# EAGLE design detector_t85-pu (EAGLE 7.6.0)

## Sheet 1 of 2
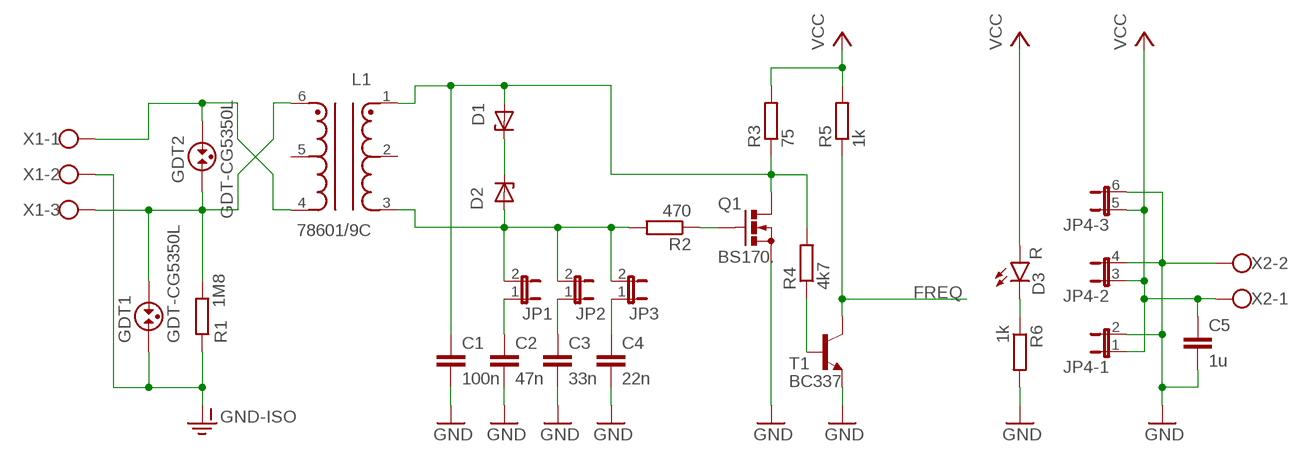
[diagram p0: schematic, sheet 1]

### Parts
C1  100n  C-EU050-024X044  [C050-024X044]
C2  47n  C-EU050-024X044  [C050-024X044]
C3  33n  C-EU050-024X044  [C050-024X044]
C4  22n  C-EU050-024X044  [C050-024X044]
C5  1u  C-EU050-025X075  [C050-025X075]
D1  24V  ZENER-DIODEZD-5  [ZDIO-5]
D2  24V  ZENER-DIODEZD-5  [ZDIO-5]
D3  R  LED3MM  [LED3MM]
GDT1  GDT-CG5350L  [CG5350L]
GDT2  GDT-CG5350L  [CG5350L]
JP1  JUMPER-2PTH  [1X02]
JP2  JUMPER-2PTH  [1X02]
JP3  JUMPER-2PTH  [1X02]
JP4  JP3QE  [JP3Q]
L1  78601/9C  [78601/9C]
Q1  BS170.  [TO92-DGS]
R1  1M8  R-EU_0204/5  [0204/5]
R2  470  R-EU_0204/5  [0204/5]
R3  75  R-EU_0204/7  [0204/7]
R4  4k7  R-EU_0204/5  [0204/5]
R5  1k  R-EU_0204/5  [0204/5]
R6  1k  R-EU_0204/5  [0204/5]
T1  BC337  BC337-NPN-TO92-CBE  [TO92-CBE]
X1  W237-103  [W237-103]
X2  W237-102  [W237-102]

### Nets
FREQ: R5.1 T1.C ; also sheet 2
GND: C1.2 C2.2 C3.2 C4.2 C5.2 JP4.2 JP4.4 JP4.6 Q1.S R6.2 T1.E X2.2 ; also sheet 2
GND-ISO: GDT1.1 R1.1 X1.2
N$1: D1.C D2.C
N$2: R4.1 T1.B
N$3: Q1.G R2.1
N$4: C3.1 JP2.1
N$5: C4.1 JP3.1
N$6: D2.A JP1.2 JP2.2 JP3.2 L1.3 R2.2
N$7: GDT2.2 L1.4 X1.1
N$11: C2.1 JP1.1
N$14: C1.1 D1.A L1.1 Q1.D R3.1 R4.2
N$21: GDT1.2 GDT2.1 L1.6 R1.2 X1.3
N$22: D3.K(C) R6.1
VCC: C5.1 D3.A JP4.1 JP4.3 JP4.5 R3.2 R5.2 X2.1 ; also sheet 2
Unconnected: L1.2 L1.5

## Sheet 2 of 2
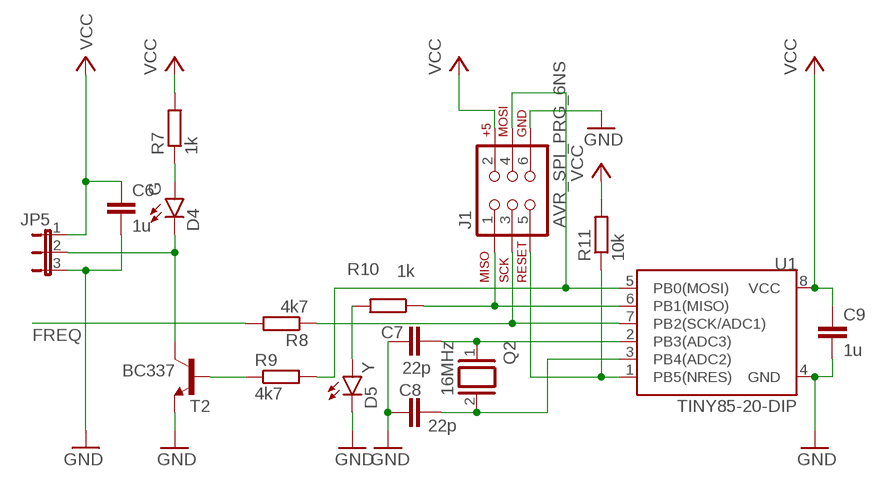
[diagram p1: schematic, sheet 2]

### Parts
C6  1u  C-EU050-025X075  [C050-025X075]
C7  22p  CAPPTH2  [CAP-PTH-SMALL2]
C8  22p  CAPPTH2  [CAP-PTH-SMALL2]
C9  1u  C-EU050-025X075  [C050-025X075]
D4  G  LED3MM  [LED3MM]
D5  Y  LED3MM  [LED3MM]
J1  AVR_SPI_PRG_6NS  [2X3-NS]
JP5  JP2E  [JP2]
Q2  16MHz  XTAL/S  [QS]
R7  1k  R-EU_0204/5  [0204/5]
R8  4k7  R-EU_0204/5  [0204/5]
R9  4k7  R-EU_0204/5  [0204/5]
R10  1k  R-EU_0204/5  [0204/5]
R11  10k  R-EU_0204/5  [0204/5]
T2  BC337  BC337-NPN-TO92-CBE  [TO92-CBE]
U1  TINY85-20-DIP  ATTINY45TINY45-20-DIP  [DIP08]

### Nets
FREQ: R8.2 ; also sheet 1
GND: C6.2 C7.1 C8.1 C9.2 D5.K(C) J1.6 JP5.3 T2.E U1.4(GND) ; also sheet 1
N$20: R9.1 T2.B
N$23: D4.K(C) JP5.2 T2.C
N$24: D4.A R7.1
N$25: C7.2 Q2.1 U1.2(PB3(ADC3))
N$26: C8.2 Q2.2 U1.3(PB4(ADC2))
N$27: D5.A R10.2
N$28: J1.1 R10.1 U1.6(PB1(MISO))
N$29: J1.4 R9.2 U1.5(PB0(MOSI))
N$30: J1.5 R11.1 U1.1(PB5(NRES))
N$31: J1.3 R8.1 U1.7(PB2(SCK/ADC1))
VCC: C6.1 C9.1 J1.2 JP5.1 R7.2 R11.2 U1.8(VCC) ; also sheet 1

## Library data of the parts
C1-C4 = resistor:C-EU: CAPACITOR, European symbol
C5 C6 C9 = rcl:C-EU: CAPACITOR, European symbol
C7 C8 = SparkFun-Capacitors:CAP: Capacitor Standard 0603 ceramic capacitor, and 0.1" leaded capacitor.
D1 D2 = diode:ZENER-DIODE: Z-Diode
D3-D5 = SparkFun-LED:LED: LEDs Standard schematic elements and footprints for 5mm, 3mm, 1206, and 0603 sized LEDs. 5mm - Spark Fun Electronics SKU : COM-00529 (and others); PROD_ID: DIO-08794
GDT1 GDT2 = supressor:GDT-: GAS DISCHARGE TUBE
J1 = SparkFun-Connectors:AVR_SPI_PRG_6: AVR ISP 6 Pin This is the reduced ISP connector for AVR programming. Common on Arduino. This footprint will take up less PCB space and can be used with a 10-pin to 6-pin adapter such as SKU: BOB-08508 **Special note about "TEST_POINT" package. The stop mask is on the top side, so if you want your programming test points to be on the bottom of your board, make sure to place this package on the bottom side of the board. This also ensure that the orientation to program from the bottom side will be correct.
JP1-JP3 = SparkFun-Retired:JUMPER-2: Jumper Basic 0.1" spaced jumper. Use with breakaway headers.
JP4 = jumper:JP3QE: JUMPER
JP5 = jumper:JP2E: JUMPER
L1 = detector:78601/9C: MuRata 78601/9C
Q1 = detector:BS170: N-CHANNEL MOS FET
Q2 = special:XTAL/S: CRYSTAL
R1-R11 = resistor:R-EU_: RESISTOR, European symbol
T1 T2 = transistor:*-NPN-: NPN Transistror BF959 corrected 2008.03.06
U1 = SparkFun-DigitalIC:ATTINY45: Atmel 8-pin 2/4/8kB flash uC; PROD_ID: IC-09439; VALUE: TINY45-20-DIP
X1 = con-wago-500:W237-103: WAGO SCREW CLAMP; MPN: 237-103; OC_FARNELL: unknown; OC_NEWARK: 18M7116
X2 = con-wago-500:W237-102: WAGO SCREW CLAMP; MPN: 237-102; OC_FARNELL: unknown; OC_NEWARK: 70K9898

## Board
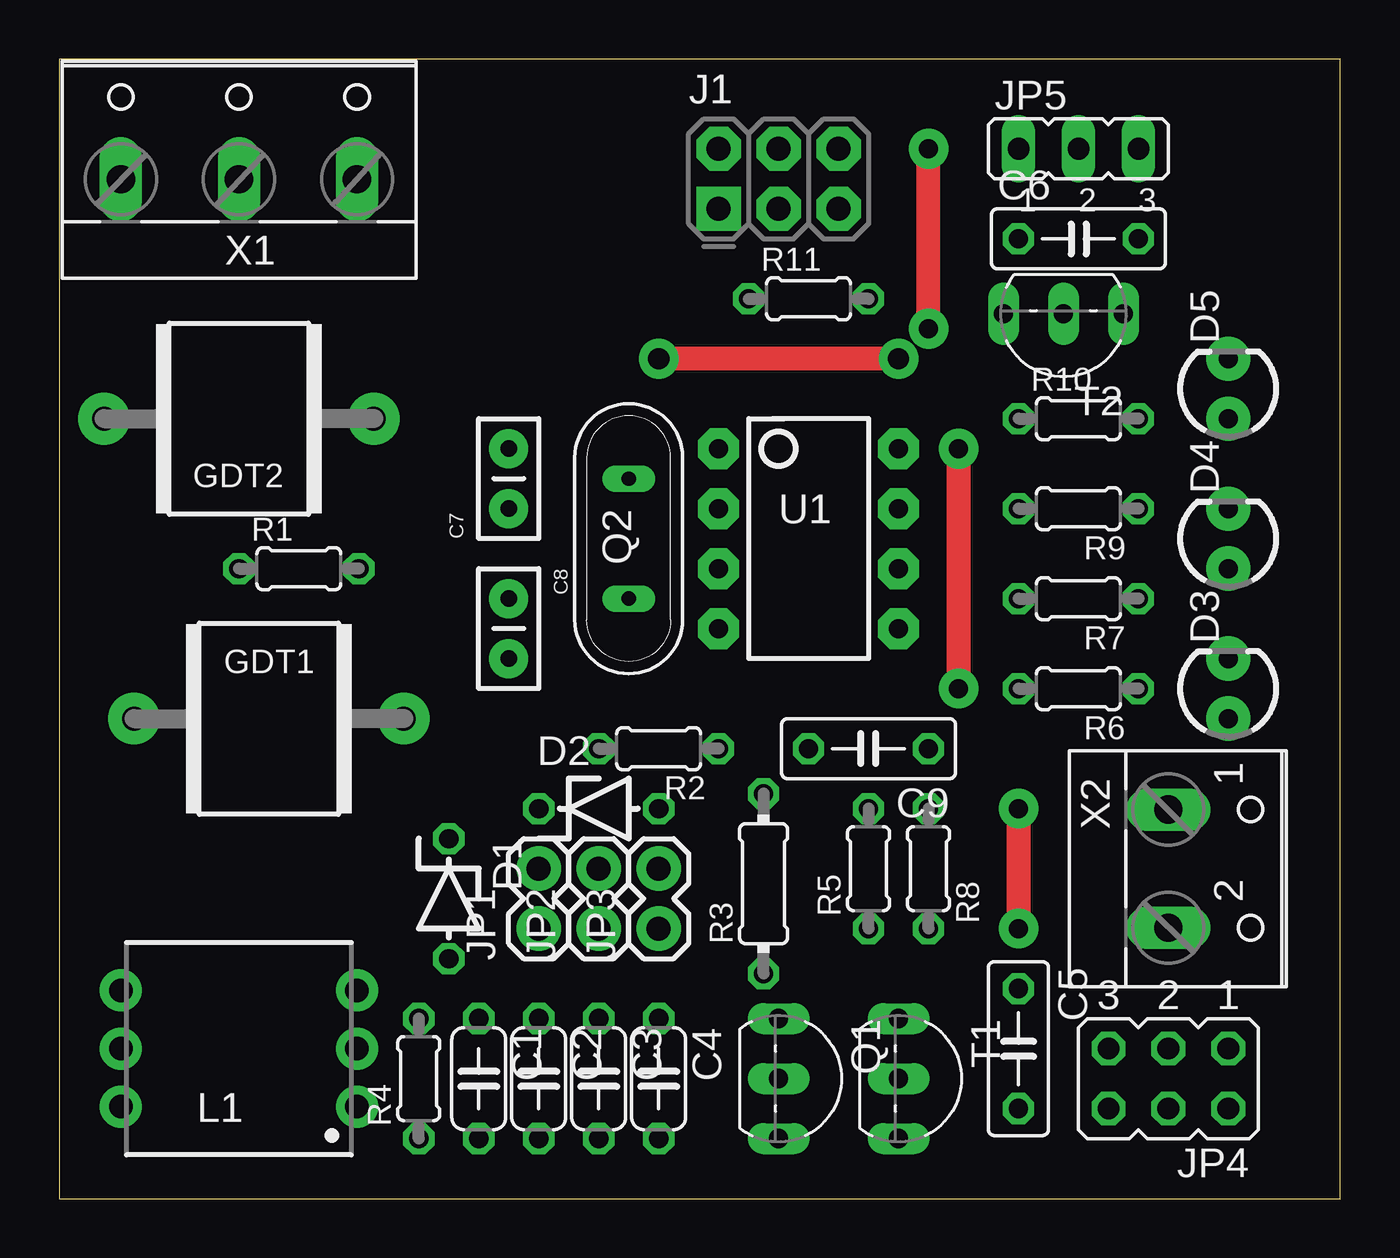
[diagram p2: board, top side]
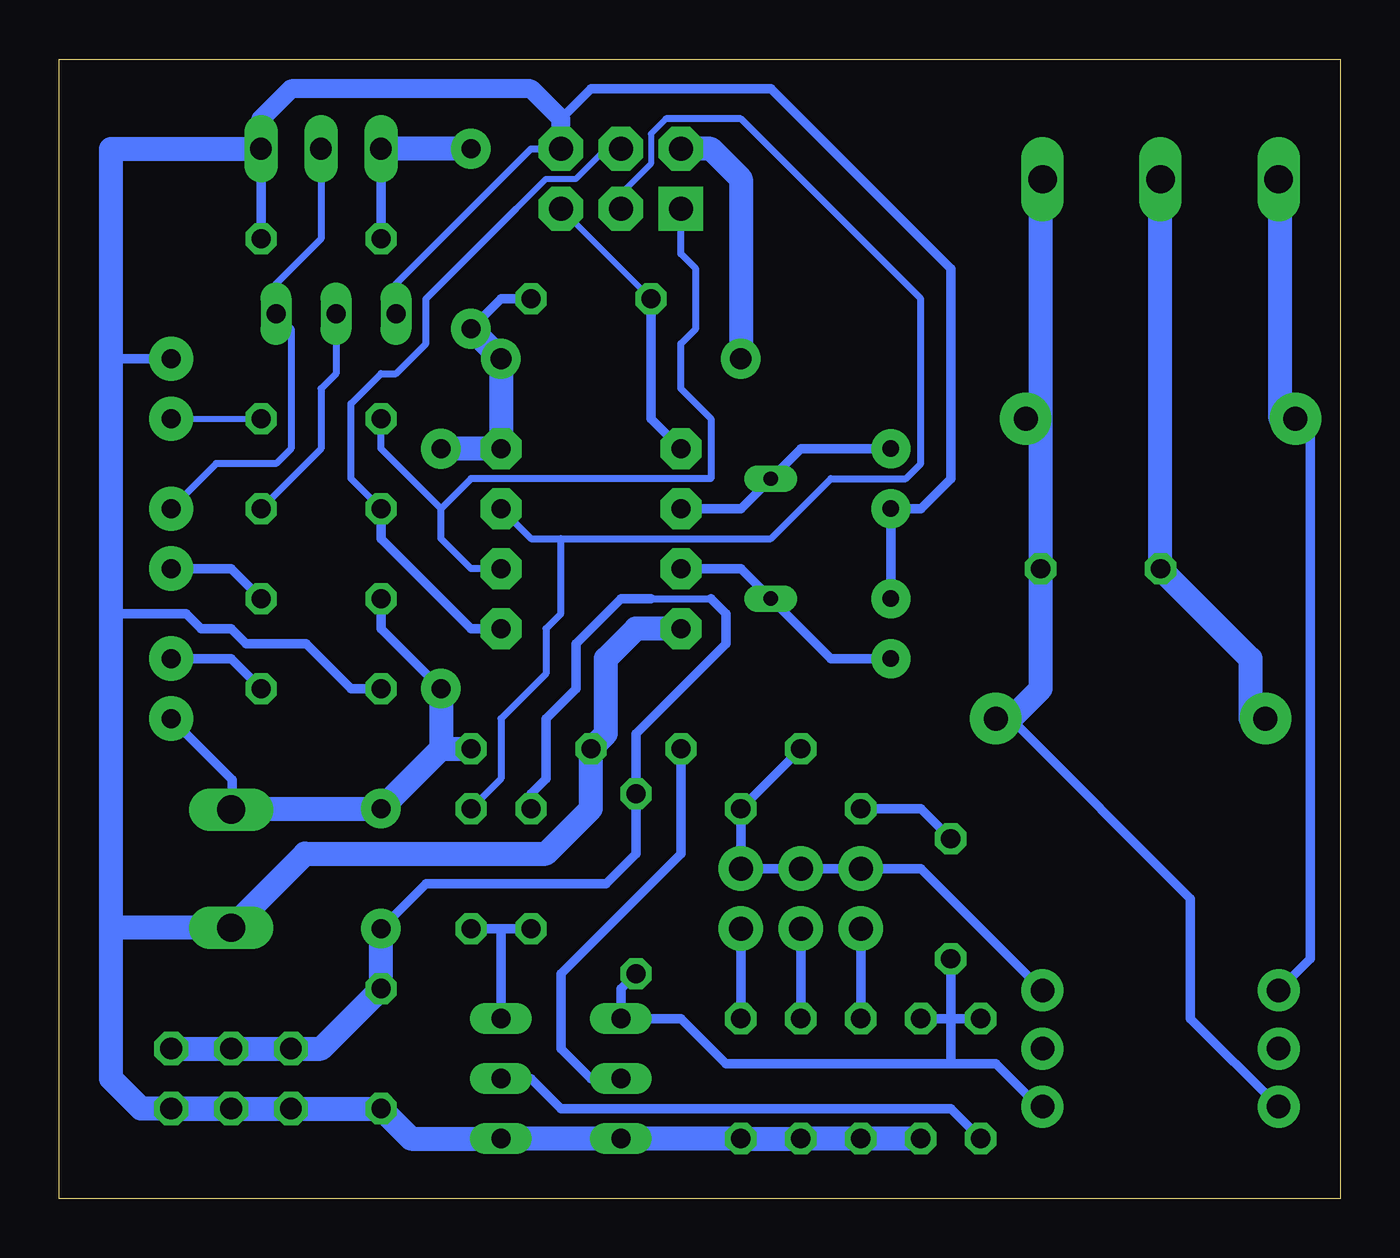
[diagram p3: board, bottom side, seen from below]

Size 54.28 x 48.25 mm. Coordinates in mm from the lower left corner, seen from the top.
Outline: 0,0 54.28,0 54.28,48.25 0,48.25 0,0
Copper layers (1*16): Top 0.035mm / dielectric 1.5mm / Bottom 0.035mm
Design rules "default": minimum track width 10mil, minimum drill 24mil, track to track 8mil, track to pad 8mil, pad to pad 8mil, via to via 8mil, smd to smd 8mil, copper to edge 40mil, drill to drill 8mil, minimum pad ring 10mil, minimum via ring 8mil, stop-mask expansion 4mil, vias tented up to drill 0mil, thermal gap 10mil

### Footprints (pad centres in the part's own frame; a part is rotated, then mirrored left to right if it is on the bottom)
C050-024X044 = drill 0.813 octagon: 1 -2.54,0; 2 2.54,0
C050-025X075 = drill 0.813 octagon: 1 -2.54,0; 2 2.54,0
CAP-PTH-SMALL2 = drill 0.7 pad 1.651: 1 0,0; 2 2.54,0
ZDIO-5 = drill 0.813 octagon: A 2.54,0; C -2.54,0
LED3MM = drill 0.813 pad 1.88: A -1.27,0; K 1.27,0
CG5350L = drill 1.016 pad 2.184: 1 -5.715,0; 2 5.715,0
2X3-NS = drill 1.016 pad 1.88 square: 1 -2.54,-1.27 | drill 1.016 pad 1.88 octagon: 2 -2.54,1.27; 3 0,-1.27; 4 0,1.27; 5 2.54,-1.27; 6 2.54,1.27
1X02 = drill 1.016 pad 1.88: 1 0,0; 2 2.54,0
JP3Q = drill 0.914 octagon: 1 -2.54,-1.27; 2 -2.54,1.27; 3 0,-1.27; 4 0,1.27; 5 2.54,-1.27; 6 2.54,1.27
JP2 = drill 0.914 long: 1 -2.54,0; 2 0,0; 3 2.54,0
78601/9C = drill 1 pad 1.778: 1 -5,2.46; 2 -5,0; 3 -5,-2.46; 4 5,-2.46; 5 5,0; 6 5,2.46
TO92-DGS = drill 0.813 long: D -2.54,0; G 0,0; S 2.54,0
QS = drill 0.61 long: 1 -2.54,0; 2 2.54,0
0204/5 = drill 0.813 octagon: 1 -2.54,0; 2 2.54,0
0204/7 = drill 0.813 octagon: 1 -3.81,0; 2 3.81,0
TO92-CBE = drill 0.813 long: B 0,0; C -2.54,0; E 2.54,0
DIP08 = drill 0.813 pad 1.727 octagon: 1 -3.81,-3.81; 2 -1.27,-3.81; 3 1.27,-3.81; 4 3.81,-3.81; 5 3.81,3.81; 6 1.27,3.81; 7 -1.27,3.81; 8 -3.81,3.81
W237-103 = drill 1.194 long: 1 -5,-1.29; 2 0,-1.29; 3 5,-1.29
W237-102 = drill 1.194 long: 1 -2.5,-1.27; 2 2.5,-1.27

### Placement (x,y rotation side)
C1  17.78,5.08 270 top
C2  20.32,5.08 270 top
C3  22.86,5.08 270 top
C4  25.4,5.08 270 top
C5  40.64,6.35 270 top
C6  43.18,40.64 0 top
C7  19.05,29.21 90 top
C8  19.05,25.4 270 top
C9  34.29,19.05 180 top
D1  16.51,12.7 270 top
D2  22.86,16.51 0 top
D3  49.53,21.59 90 top
D4  49.53,27.94 90 top
D5  49.53,34.29 90 top
GDT1  8.89,20.32 0 top
GDT2  7.62,33.02 180 top
J1  30.48,43.18 0 top
JP1  20.32,11.43 90 top
JP2  22.86,11.43 90 top
JP3  25.4,11.43 90 top
JP4  46.99,5.08 180 top
JP5  43.18,44.45 0 top
L1  7.62,6.35 180 top
Q1  30.48,5.08 270 top
Q2  24.13,27.94 270 top
R1  10.16,26.67 0 top
R2  25.4,19.05 180 top
R3  29.85,13.34 90 top
R4  15.24,5.08 90 top
R5  34.29,13.97 90 top
R6  43.18,21.59 180 top
R7  43.18,25.4 180 top
R8  36.83,13.97 270 top
R9  43.18,29.21 180 top
R10  43.18,33.02 0 top
R11  31.75,38.1 0 top
T1  35.56,5.08 270 top
T2  42.55,37.47 180 top
U1  31.75,27.94 270 top
X1  7.62,44.45 0 top
X2  48.26,13.97 270 top

### Tracks (layer width: path | path; a pad name or v marks a point on that pad's centre or on a via)
FREQ
  Bottom 0.406: R8.2 35.56,11.43 | 35.56,11.43 R5.1 | T1.C 35.56,11.43
GND
  Bottom 0.305: T2.E 40,38.73 34.29,44.45 J1.6
  Bottom 0.406: D5.K 52.07,35.56 | C6.2 JP5.3 | R6.2 41.91,21.59 43.81,23.5 46.35,23.5 46.99,24.13 48.26,24.13 48.89,24.77 52.07,24.77 | C8.1 C7.1 17.78,29.21 16.51,30.48 16.51,39.37 24.13,46.99 31.75,46.99 33.02,45.72
  Bottom 0.813: J1.6 33.02,45.72 34.29,46.99 44.45,46.99 45.72,45.72 JP5.3
  Bottom 1.016: C1.2 C2.2 C3.2 C4.2 Q1.S T1.E 39.37,2.54 C5.2 JP4.6 JP4.4 | JP4.2 JP4.4 | JP4.4 50.8,3.81 52.07,5.08 52.07,11.43 | 52.07,11.43 52.07,24.77 52.07,35.56 52.07,44.45 JP5.3 | U1.4 29.85,24.13 31.11,22.86 31.11,19.68 C9.2 31.75,16.51 33.66,14.61 43.85,14.61 X2.2 52.03,11.47 52.07,11.43
GND-ISO
  Bottom 1.016: GDT1.1 3.81,20.32 3.81,22.86 R1.1 X1.2
N$1
  Bottom 0.406: D1.C 17.78,16.51 D2.C
N$2
  Bottom 0.406: R4.1 16.51,3.81 33.02,3.81 34.29,5.08 T1.B
N$3
  Bottom 0.406: R2.1 27.94,14.61 33.02,9.53 33.02,6.35 31.75,5.08 Q1.G
N$4
  Bottom 0.406: C3.1 JP2.1
N$5
  Bottom 0.406: JP3.1 C4.1
N$6
  Bottom 0.406: L1.3 17.78,13.97 JP1.2 JP2.2 JP3.2 D2.A R2.2
N$7
  Bottom 0.406: L1.4 1.27,10.16 1.27,33.02 GDT2.2
  Bottom 1.016: X1.1 2.54,41.91 2.54,33.02 GDT2.2
N$11
  Bottom 0.406: C2.1 JP1.1
N$14
  Bottom 0.406: L1.1 12.7,3.81 14.61,5.71 16.51,5.71 | C1.1 16.51,7.62 | 16.51,7.62 R4.2 | 16.51,5.71 26.04,5.71 27.94,7.62 Q1.D 30.48,8.89 R3.1 | D1.A 16.51,7.62 | 16.51,7.62 16.51,5.71
N$20
  Bottom 0.305: T2.B 42.55,34.92 43.18,34.29 43.18,31.75 R9.1
N$21
  Bottom 0.406: 13.97,20.32 6.35,12.7 6.35,7.62 L1.6 2.54,3.81
  Bottom 1.016: 12.7,33.02 12.7,41.91 X1.3 | GDT1.2 13.97,20.32 12.7,21.59 R1.2 12.7,33.02 | 12.7,33.02 GDT2.1
N$22
  Bottom 0.406: R6.1 46.99,22.86 D3.K
N$23
  Bottom 0.305: D4.K 47.62,31.11 45.08,31.11 44.45,31.75 44.45,36.83 T2.C 45.08,38.73 43.18,40.64 JP5.2
N$24
  Bottom 0.406: R7.1 46.99,26.67 D4.A
N$25
  Bottom 0.406: C7.2 22.86,31.75 Q2.1 25.4,29.21 U1.2
N$26
  Bottom 0.406: C8.2 21.59,22.86 Q2.2 25.4,26.67 U1.3
N$27
  Bottom 0.254: D5.A R10.2
N$28
  Bottom 0.305: U1.6 36.83,26.67 38.1,27.94 38.1,29.21 | 38.1,29.21 40.64,31.75 R10.1 | 38.1,29.21 36.83,30.48 26.67,30.48 26.67,33.02 27.94,34.29 27.94,36.2 27.3,36.83 27.3,39.37 27.94,40.01 J1.1
N$29
  Bottom 0.254: J1.4 31.11,44.45 32.39,43.18 33.66,43.18 34.92,41.91
  Bottom 0.305: R9.2 41.91,30.48 41.91,33.66 40.64,34.92 40,34.92 38.73,36.2 38.73,38.1 34.92,41.91
  Bottom 0.406: R9.2 40.64,27.94 36.83,24.13 U1.5
N$30
  Bottom 0.254: R11.1 J1.5
  Bottom 0.406: R11.1 29.21,33.02 U1.1
N$31
  Bottom 0.254: J1.3 30.48,42.55 29.21,43.81 29.21,45.09 28.57,45.72
  Bottom 0.305: R8.1 35.56,17.78 35.56,20.32 33.66,22.23 33.66,24.13 33.02,24.77 33.02,27.94 | 33.02,27.94 34.29,27.94 U1.7 | 33.02,27.94 24.13,27.94 21.59,30.48 18.42,30.48 17.78,31.11 17.78,38.1 25.4,45.72 28.57,45.72
VCC  (via drill 0.8 pad 1.68, 0.9 pad 1.68)
  Top 1.016: v40.64,16.51 v40.64,11.43 | v36.83,36.83 v36.83,44.45 | v38.1,31.75 v38.1,21.59 | v35.56,35.56 v25.4,35.56
  Bottom 0.305: 29.21,25.4 26.67,25.4
  Bottom 0.406: R11.2 35.56,38.1 v36.83,36.83 | v40.64,11.43 38.73,13.34 31.11,13.34 29.85,14.61 R3.2 29.85,19.68 26.04,23.5 26.04,24.77 26.67,25.4 | C6.1 JP5.1 | R7.2 40.64,24.13 v38.1,21.59 | 46.95,16.51 46.95,17.74 D3.A | R5.2 34.29,17.14 33.66,17.78 33.66,20.32 32.39,21.59 32.39,23.5 30.48,25.4 29.21,25.4
  Bottom 1.016: X2.1 46.95,16.51 v40.64,16.51 38.1,19.05 | v36.83,44.45 JP5.1 | v38.1,31.75 U1.8 v35.56,35.56 v36.83,36.83 | JP4.1 JP4.3 JP4.5 43.18,6.35 C5.1 v40.64,11.43 | v25.4,35.56 25.4,43.18 26.67,44.45 J1.2 | 38.1,19.05 C9.1 | v38.1,21.59 38.1,19.05